# Altium project HighVolBoost.PrjPcb
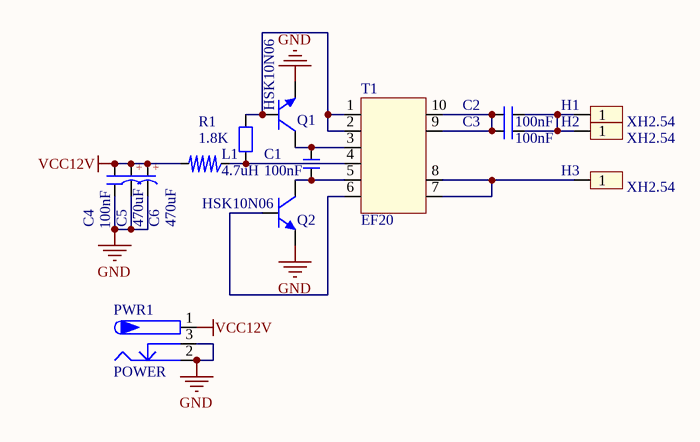
[diagram p0: HighVolBoost.SchDoc]
1 sheet, 15 parts. Net scope: global (net labels, ports and power ports of the same name join across sheets).
Board file: HighVolBoost.PcbDoc

## Sheet HighVolBoost.SchDoc
size A4

### Parts
C1  100nF  [CY 10*14*5]
C2  100nF  [CY 7.5*8*4]
C3  100nF  [CY 7.5*8*4]
C4  100nF  [C 0805_L]
C5  470uF  [CM D(6.3*7.7)]
C6  470uF  [CM D(6.3*7.7)]
H1  XH2.54  [HDR2.54-LI-1P]
H2  XH2.54  [HDR2.54-LI-1P]
H3  XH2.54  [HDR2.54-LI-1P]
L1  4.7uH  [PK0810]
PWR1  POWER  [DC-005]
Q1  HSK10N06  [SOT89_N]
Q2  HSK10N06  [SOT89_N]
R1  1.8K  [R 0805_L]
T1  EF20  [BYQ_HVB]

### Nets
GND: C4.1 C5.2(K) C6.2(K) PWR1.2 PWR1.3 Q1.3(E) Q2.3(E)
VCC12V: C4.2 C5.1(A) C6.1(A) L1.2 PWR1.1
NetC1_1: C1.1 Q2.2(C) T1.5
NetC1_2: C1.2 Q1.2(C) T1.3
NetC2_1: C2.1 C3.1 H1.1 H2.1
NetC2_2: C2.2 C3.2 T1.9 T1.10
NetH3_1: H3.1 T1.7 T1.8
NetL1_1: L1.1 R1.1 T1.4
NetQ1_1: Q1.1(B) R1.2 T1.1 T1.2
NetQ2_1: Q2.1(B) T1.6

### Notes on the sheet
- (in symbol C-CM) +

### Library data of the parts
C1-C4 = C: 无极性贴片电容; BOM名称: 无极性贴片电容
C5 C6 = C-CM: 贴片电解电容; BOM名称: 贴片电解电容
H1-H3 = Header_1P: 端子
L1 = L_SOP: 电感
PWR1 = P-DC: 低压电源接口; BOM名称: DC电源接口
Q1 Q2 = 8050-SMD: 高频放大-NPN型; BOM名称: 高频放大-NPN型
R1 = R: 贴片电阻
T1 = BYQ_HVB: 高压变压器